# Altium schematic sheet ROOT.SchDoc: ROOT
size A4; Author: Peter Tanner; SheetNumber: 1; SheetTotal: 9; SPICEModelCacheOJDLQUBK: <root> / <DocumentId>OJDLQUBK</DocumentId> / </root>
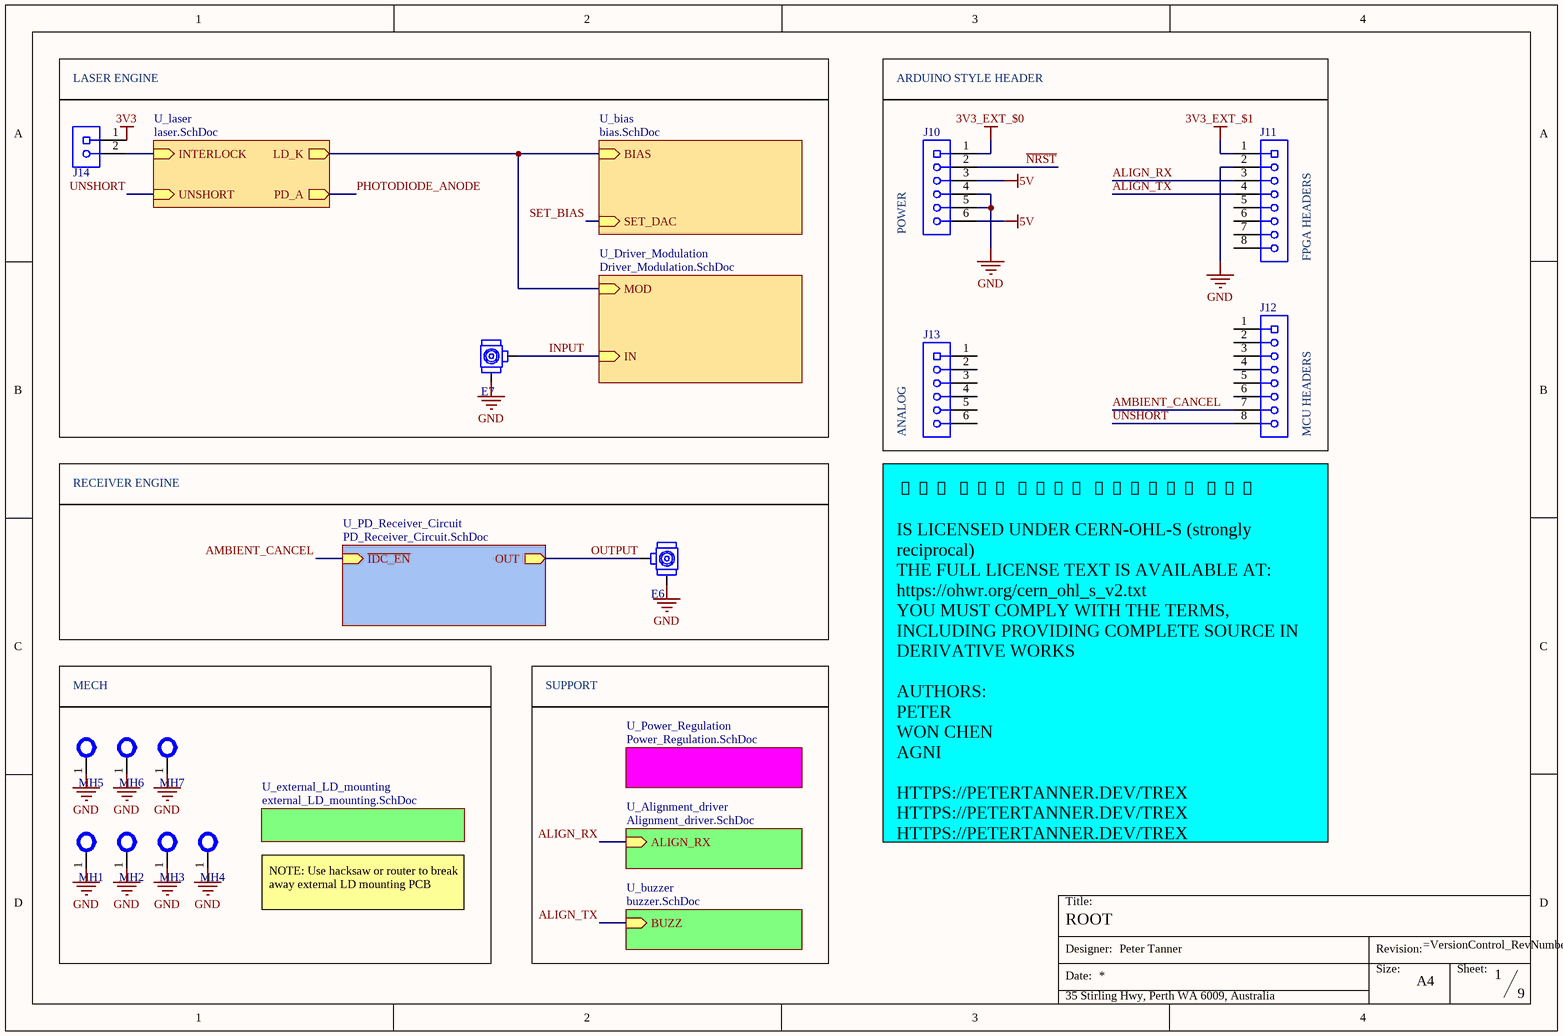
[diagram p0: ROOT.SchDoc]

## Parts
E6  U.FL-R-SMT-1(01)  [HRS-U.FL-R-SMT-3_V 4_LAYER_KO]  (value not drawn)
E7  U.FL-R-SMT-1(01)  [HRS-U.FL-R-SMT-3_V 4_LAYER_KO]  (value not drawn)
J10  68000-406HLF  [68000-406HLF-Footprint-1]  (value not drawn)
J11  22-28-4080  [22-28-4080-Footprint-1]  (value not drawn)
J12  22-28-4080  [22-28-4080-Footprint-1]  (value not drawn)
J13  68000-406HLF  [68000-406HLF-Footprint-1]  (value not drawn)
J14  22-28-4020  [22-28-4020-Footprint-1]  (value not drawn)
MH1  Mounting hole M3  [Mounting hole M3-Footprint-1]  (value not drawn)  (no BOM)
MH2  Mounting hole M3  [Mounting hole M3-Footprint-1]  (value not drawn)  (no BOM)
MH3  Mounting hole M3  [Mounting hole M3-Footprint-1]  (value not drawn)  (no BOM)
MH4  Mounting hole M3  [Mounting hole M3-Footprint-1]  (value not drawn)  (no BOM)
MH5  Mounting hole M3  [Mounting hole M3-Footprint-1]  (value not drawn)  (no BOM)
MH6  Mounting hole M3  [Mounting hole M3-Footprint-1]  (value not drawn)  (no BOM)
MH7  Mounting hole M3  [Mounting hole M3-Footprint-1]  (value not drawn)  (no BOM)

## Blocks framed on the sheet
LASER ENGINE: E7 J14
RECEIVER ENGINE: E6
MECH: MH1-MH7

## Sub-sheets
U_Alignment_driver = Alignment_driver.SchDoc: ALIGN_RX (in)
U_bias = bias.SchDoc: BIAS (in), SET_DAC (in)
U_buzzer = buzzer.SchDoc: BUZZ (in)
U_Driver_Modulation = Driver_Modulation.SchDoc: IN (in), MOD (in)
U_external_LD_mounting = external_LD_mounting.SchDoc: no entries
U_laser = laser.SchDoc: PD_A (out), LD_K (out), UNSHORT (in), INTERLOCK (in)
U_PD_Receiver_Circuit = PD_Receiver_Circuit.SchDoc: OUT (out), ~{IDC_EN} (in)
U_Power_Regulation = Power_Regulation.SchDoc: no entries

## Nets
3V3: J14.1
3V3_EXT_$0: J10.1
3V3_EXT_$1: J11.1
5V: J10.3 J10.6
GND: E6.2(GND) E7.2(GND) J10.4 J10.5 J11.2 MH1.1 MH2.1 MH3.1 MH4.1 MH5.1 MH6.1 MH7.1
~{NRST}: J10.2
ALIGN_RX: J11.3 ; sheet U_Alignment_driver/ALIGN_RX
ALIGN_TX: J11.4 ; sheet U_buzzer/BUZZ
AMBIENT_CANCEL: J12.7 ; sheet U_PD_Receiver_Circuit/~{IDC_EN}
INPUT: E7.1(SIG) ; sheet U_Driver_Modulation/IN
OUTPUT: E6.1(SIG) ; sheet U_PD_Receiver_Circuit/OUT
PHOTODIODE_ANODE: sheet U_laser/PD_A
SET_BIAS: sheet U_bias/SET_DAC
UNSHORT: J12.8 ; sheet U_laser/UNSHORT
NetJ14_2: J14.2 ; sheet U_laser/INTERLOCK
(unnamed): sheet U_laser/LD_K, sheet U_bias/BIAS, sheet U_Driver_Modulation/MOD

Not connected (* = marked no-connect by the designer): J11 5 6 7 8; J12 1 2 3 4 5 6; J13 1 2 3 4 5 6

## Notes on the sheet
- ARDUINO STYLE HEADER
- (near J10) POWER
- (near J11) FPGA HEADERS
- (near J13) ANALOG
- (near J12) MCU HEADERS
- SUPPORT
- 🦖🦖🦖 THE TREX SYSTEM 🦖🦖🦖
  IS LICENSED UNDER CERN-OHL-S (strongly reciprocal)
  THE FULL LICENSE TEXT IS AVAILABLE AT:
  https://ohwr.org/cern_ohl_s_v2.txt
  YOU MUST COMPLY WITH THE TERMS, INCLUDING PROVIDING COMPLETE SOURCE IN DERIVATIVE WORKS
  AUTHORS:
  PETER
  WON CHEN
  AGNI
  HTTPS://PETERTANNER.DEV/TREX
  HTTPS://PETERTANNER.DEV/TREX
  HTTPS://PETERTANNER.DEV/TREX
- NOTE: Use hacksaw or router to break away external LD mounting PCB
- Title:
- Designer:
- Date:
- Size:
- Revision:
- A4
- Sheet:
- 35 Stirling Hwy, Perth WA 6009, Australia

## Library data of the parts
E6 E7 = CMP-00380-18: Rf Connectors / Coaxial Connectors SMT Ml Rec Au 50 Ohm W/anti Sldr Wicking UFL; Number of Ports: 1; Dielectric Material: Polymer; Impedance: 50; Mating Cycles: 30; Connector Type: Receptacle,Male Pin; Body Plating: Silver; Center Contact Plating: Gold; Max Frequency: 6GHz; Body Material: Bronze; Lead Free: Lead Free; Series: U.FL; JLC PN: C88374; Contact Material: Brass; Fastening Type: SNAP-ON; Min Operating Temperature: -40°C; RoHS Compliant: Yes; Housing Color: Beige; Depth: 3mm; Contact Plating: Gold; Mount: Surface Mount; Length: 3.1mm; Orientation: Vertical; Termination: Solder; Max Operating Temperature: 90°C; Source: UWAA_Stock
J10 = CMP-00021-4: CONN HEADER 6POS .100 STR TIN; Gender: Male; Insulation Resistance: 5G; Voltage Rating: 1.5kV; Pitch: 2.54mm; Connector Type: Male Pin; Current Rating: 3A; Number of Contacts: 6; Depth: 2.41mm; Orientation: Straight; Max Operating Temperature: 125°C; Number of Rows: 1; Length: 15.24mm; Termination: Solder; Min Operating Temperature: -65°C; Housing Material: Thermoplastic; Contact Material: Bronze; Contact Plating: Tin; Housing Color: Black; RoHS Compliant: Unsure; Source: Aliexpress
J11 J12 = CMP-00439-4: Conn Unshrouded Header HDR 8 POS 2.54mm Solder ST Thru-Hole Bag; Number of Contacts: 8; Voltage Rating: 250V; Contact Resistance: 20m; Gender: Male; Current Rating: 4A; Connector Type: Male Pin; Max Operating Temperature: 75°C; Orientation: Straight; Depth: 2.49mm; Housing Color: Black; Pitch: 2.54mm; Housing Material: Thermoplastic; Min Operating Temperature: 0°C; Contact Material: Brass,Bronze; Contact Plating: Tin; RoHS Compliant: Yes; Number of Rows: 1; Termination: Solder; Mounting Technology: Through-Hole; Source: Aliexpress
J13 = CMP-00021-3: CONN HEADER 6POS .100 STR TIN; Max Voltage Rating (AC): 1.5kV; Contact Post Length: 2.41mm; Gender: Male; Insulation Resistance: 5GR; Pitch: 2.54mm; Connector Type: Male Pin; Current Rating: 3A; Number of Contacts: 6; Depth: 2.41mm; Package Quantity: 100; Packaging: Bulk; Orientation: Straight; REACH SVHC: No SVHC; Contact Gender: Male; Max Operating Temperature: 125°C; Number of Rows: 1; Length: 15.24mm; Termination: Solder; Radiation Hardening: No; Flammability Rating: UL94 V-0; Color: Black; Min Operating Temperature: -65°C; Contact Mating Length: 0.23inch; Voltage Rating: 1.5kV; Housing Material: Thermoplastic; Contact Material: Bronze; Contact Plating: Tin; Mount: Through Hole; Housing Color: Black; Number of Positions: 6
J14 = CMP-00157-5: KK 254 Breakaway Header, Vertical, 2 Circuits, Tin (Sn) Plating, Mating Pin Length 6.09mm 2 POS; Voltage Rating: 250V; Current Rating: 4A; Pitch: 2.54mm; Contact Resistance: 20m; Gender: Male; Connector Type: Male Pin; Number of Contacts: 2; RoHS Compliant: Unsure; Orientation: Straight; Number of Rows: 1; Housing Material: Nylon; Contact Material: Brass,Bronze; Housing Color: Black; Depth: 2.49mm; Source: Aliexpress; Mounting Technology: Through Hole; Max Operating Temperature: 75°C; Contact Plating: Tin; Termination: Solder; Min Operating Temperature: 0°C
MH1-MH7 = CMP-00600-10: Close fit Di3.2 mm Alt: M3 nut flange